# Altium schematic sheet V8PAL45-M3.schdoc
size 127 x 101 mm
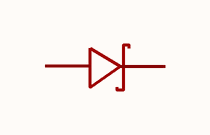
[diagram p0: V8PAL45-M3.schdoc]

## Parts
D?  V8PAL45-M3/I  [DO-221BC_L4.3-W2.7-LS5.3-RD]  (value not drawn)

## Nets

Not connected (* = marked no-connect by the designer): D? 1(A) 2(K)

## Library data of the parts
D? = V8PAL45-M3/I: Manufacturer: VISHAY(威世); Add into BOM: yes; Forward Voltage (Vf@If): 570mV@8A; Reverse Voltage (Vr): 45V; Rectified Current: 4A; Reverse Leakage Current (Ir): 1.85mA@45V; Symbol: V8PAL45-M3/I; Device: V8PAL45-M3/I; LCSC Part Name: 电压:45V 电流:4A; Supplier Part: C3759194; Manufacturer Part: V8PAL45-M3/I; Supplier Footprint: DO-221BC(SMPA); JLCPCB Part Class: Extended Part; Datasheet: https://atta.szlcsc.com/upload/public/pdf/source/20231212/E8913B3A928D0C347C4F04EA6F9113F3.pdf; Supplier: LCSC; Convert to PCB: yes